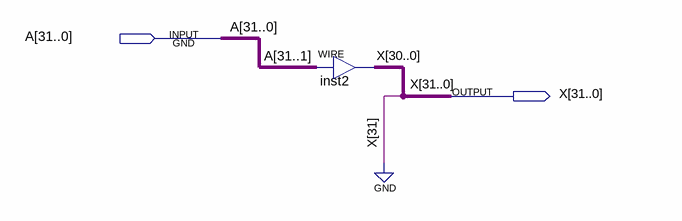
[diagram p0: schematic sheet]
// Quartus schematic shft1r32.bdf as structural Verilog: 1 symbols, 2 pins
module shft1r32 (
  input  [31:0] A,
  output [31:0] X
);

  assign X[30:0] = A[31:1];  // WIRE inst2

  assign X[31] = 1'b0;
endmodule
